# EasyEDA Pro project EasyEDA.epro

# Schematic Schematic1
Board Name: Board1; Create Date: 2025-06-01; Page Name: P1; Project Name: SmartRollerBlinds; Schematic Name: Schematic1; Update Date: 2025-07-07; Company: 嘉立创EDA; Page Size: A4; Version: V1.0
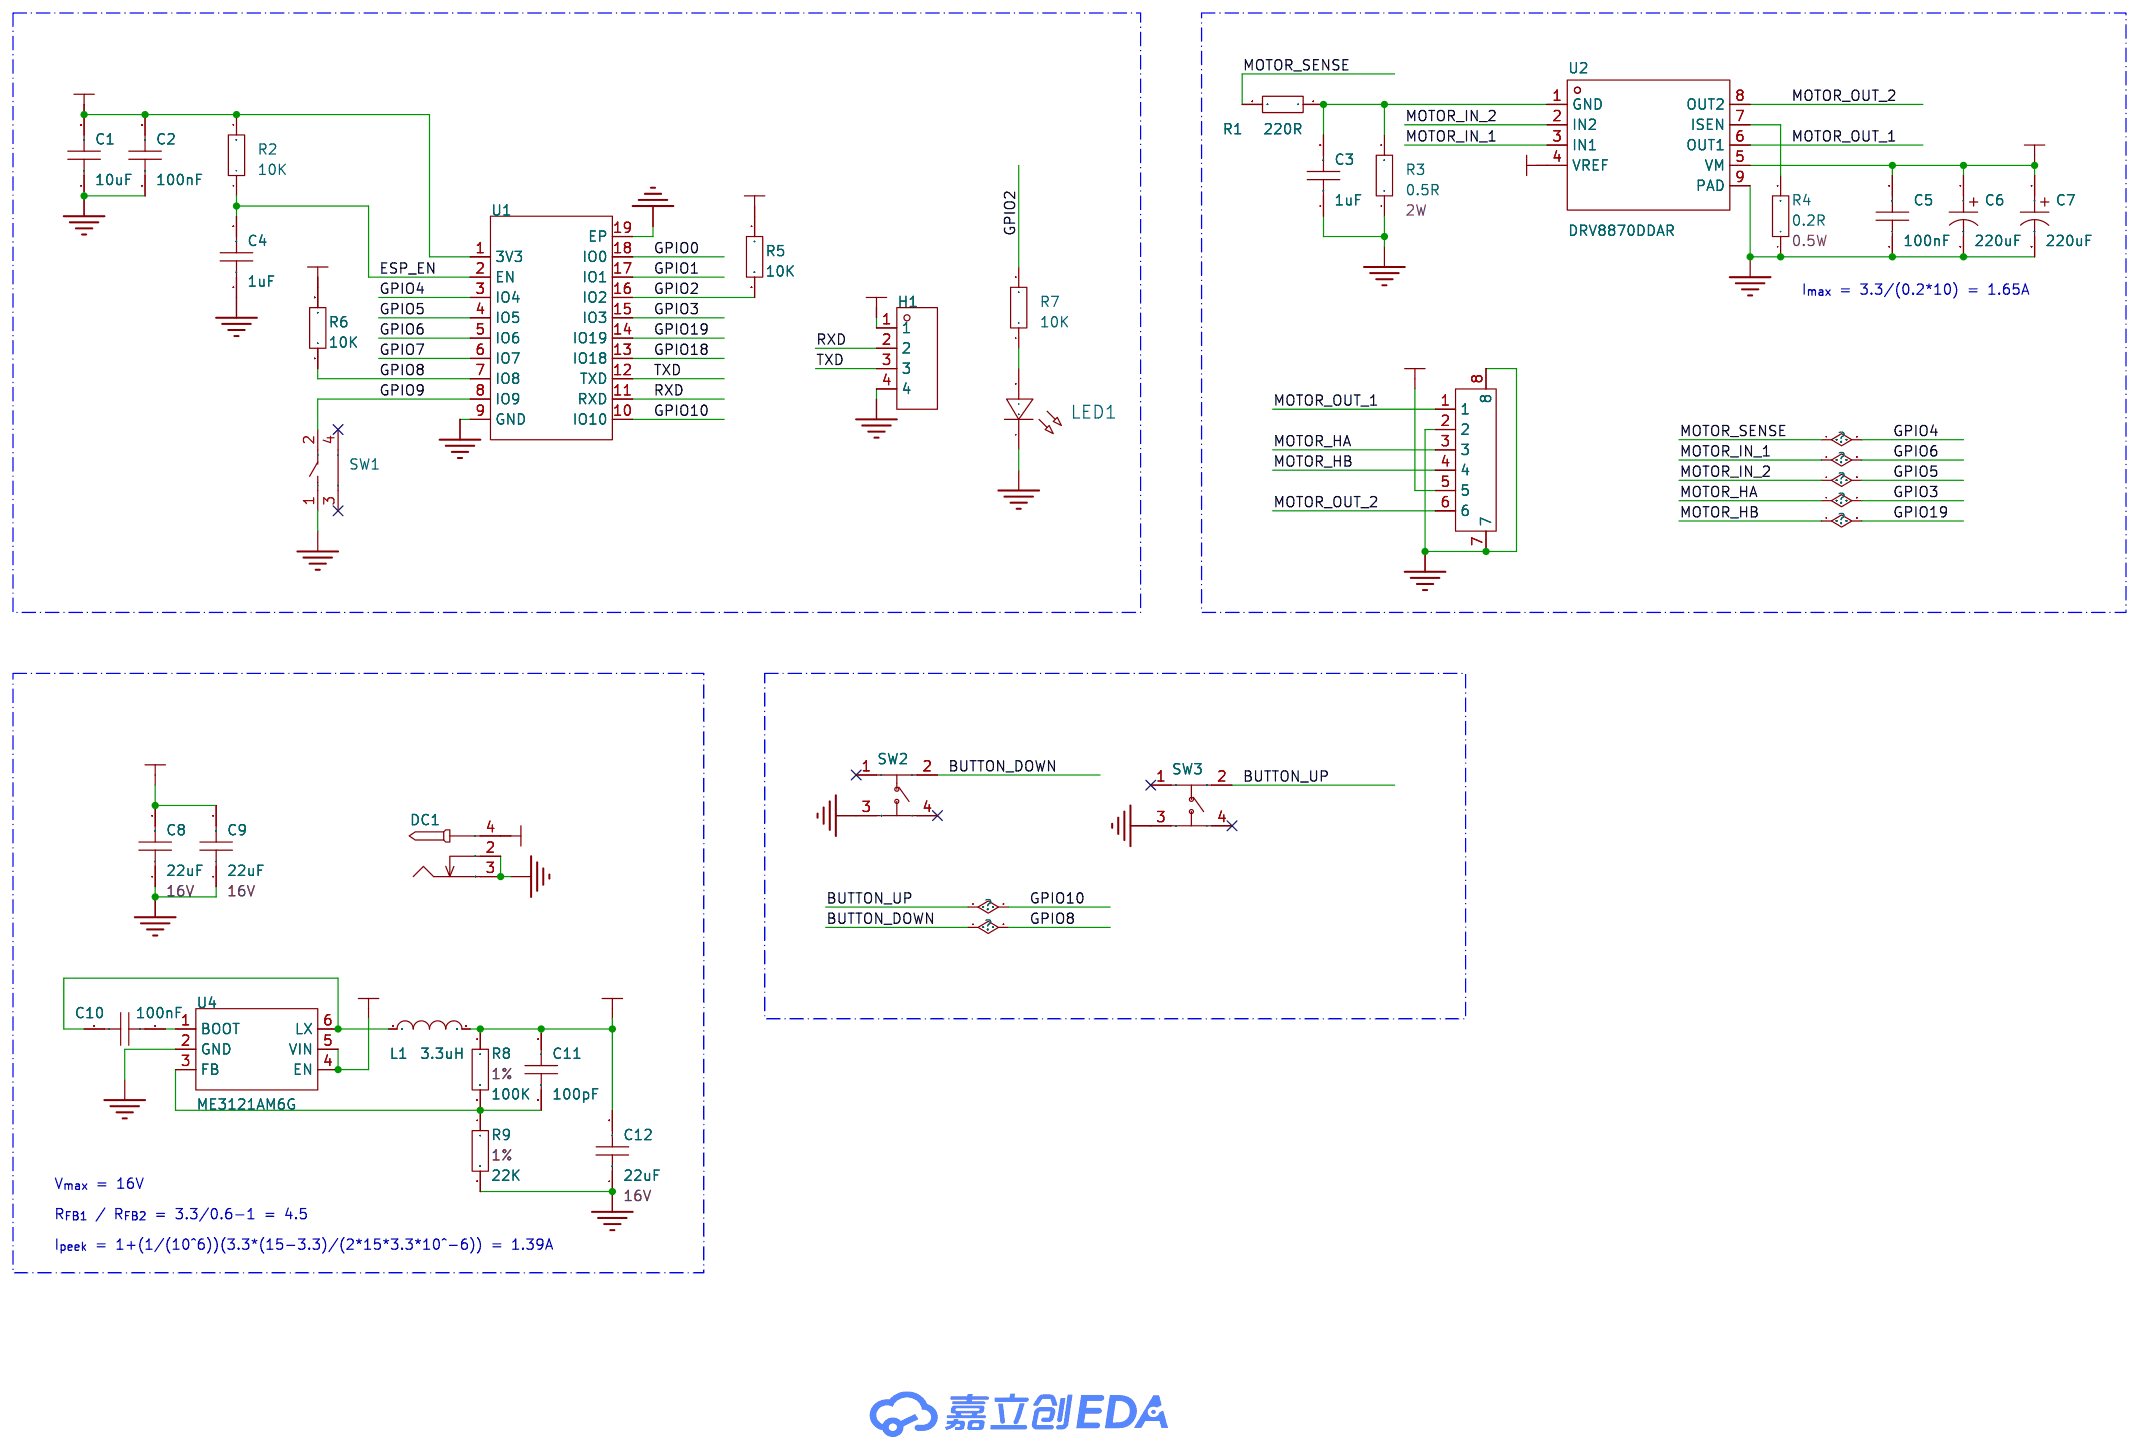
[diagram p0: schematic sheet]

## Parts
C1  10uF  [C0603]
C2  100nF  [C0603]
C3  1uF  [C0603]
C4  1uF  [C0603]
C5  100nF  [C0603]
C6  220uF  [CAP-SMD_BD6.3-L6.6-W6.6-FD]
C7  220uF  [CAP-SMD_BD6.3-L6.6-W6.6-FD]
C8  22uF  [C1206]
C9  22uF  [C1206]
C10  100nF  [C0603]
C11  100pF  [C0603]
C12  22uF  [C1206]
DC1  -  [DC-2.0]
H1  -  [HDR-TH_4P-P2.54-V-F]
L1  3.3uH  [IND-SMD_L2.5-W2.0_SWPA252012S]
LED1  -  [LED_0603]
R1  220R  [R0603]
R2  10K  [R0603]
R3  0.5R  [R2512]
R4  0.2R  [R1206]
R5  10K  [R0603]
R6  10K  [R0603]
R7  10K  [R0603]
R8  100K  [R0603]
R9  22K  [R0603]
SW1  GT-TC020A-H035-L05  [SW-SMD_GT-TC020B-H035-L05]
SW2  GT-TZ084B-H015-L1  [SW-SMD_4P-L5.2-W5.2-P3.70-LS6.4]
SW3  GT-TZ084B-H015-L1  [SW-SMD_4P-L5.2-W5.2-P3.70-LS6.4]
U1  2.4GHz  [BULETM-SMD_ESPRESSIF_ESP32-C3-WROOM-02-N4-4MB]
U2  DRV8870DDAR  [HSOP-8_L5.0-W4.0-P1.27-LS6.2-BL-EP]
U3  BX-PH2.0-6PLT  [CONN-SMD_6P-P2.00_BX-PH2.0-6PLT]
U4  ME3121AM6G  [SOT-23-6_L2.9-W1.6-P0.95-LS2.8-BR]

## Library data of the parts
C1-C5 C10 C11 = CAP_0603: Supplier Footprint: 0603
C6 C7 = RVT220UF16V67RV0015: 容值:220uF;精度:±20%;额定电压:16V;纹波电流:110mA@120Hz;等效串联电阻:-;; LCSC Part Name: 220uF ±20% 16V; Supplier Part: C2887273; Manufacturer: KNSCHA(科尼盛); Supplier Footprint: SMD,D6.3xL7.7mm; JLCPCB Part Class: 扩展库; Datasheet: https://atta.szlcsc.com/upload/public/pdf/source/20210824/3DC9999D9B098FE241E3A26137981C4C.pdf; Supplier: LCSC; Tolerance: ±20%; Rated Voltage: 16V; Ripple Current: 110mA@120Hz; φD: 6.3mm; L: 7.7mm; Lifetime @ Temp: 2000hrs@105℃; Operating Temperature: -55℃~+105℃
C8 C9 C12 = CAP_1206: 16V; Supplier Footprint: 1206
DC1 = DC-005_2.0: Supplier Footprint: 插件
H1 = HDR-F_2.54_1x4P: Supplier Part: C2718488; Supplier Footprint: 插件
L1 = 74404024022: 电感值:2.2uH;精度:±20%;额定电流:1.8A;饱和电流(Isat):1.95A;; LCSC Part Name: 2.2uH ±20% 1.95A; Supplier Part: C2046874; Manufacturer: Wurth(伍尔特); Supplier Footprint: 2520; JLCPCB Part Class: 扩展库; Datasheet: https://atta.szlcsc.com/upload/public/pdf/source/20210430/5965E2579F83C7E7E5B47693A7435A91.pdf; Supplier: LCSC; Tolerance: ±20%; Rated Current: 1.8A; Saturation Current (Isat): 1.95A; DC Resistance (DCR): 80mΩ; Ratings: AEC-Q200
LED1 = LED_0603-R: Supplier Footprint: 0603
R1 R2 R5-R7 = Res_0603: Supplier Footprint: 0603
R3 = 25121WF500LT4E: 电阻类型:厚膜电阻;阻值:500mΩ;精度:±1%;功率:1W;最大工作电压:200V;温度系数:±800ppm/℃;; LCSC Part Name: 500mΩ ±1% 1W 厚膜电阻; Supplier Part: C27777; Manufacturer: UNI-ROYAL(厚声); Supplier Footprint: 2512; JLCPCB Part Class: 扩展库; Datasheet: https://atta.szlcsc.com/upload/public/pdf/source/20200306/C422600_1E6D84923E4A46A82E41ADD87F860B5C.pdf; Supplier: LCSC; Type: 厚膜电阻; Tolerance: ±1%; Power(Watts): 2W; Overload Voltage (Max): 200V; Temperature Coefficient: ±800ppm/℃; Operating Temperature Range: -55℃~+155℃
R4 = Res_1206: 0.5W; Supplier Footprint: 1206
R8 R9 = Res_0603: 1%; Supplier Footprint: 0603
SW1 = GT-TC020A-H035-L05: 电路结构:单刀单掷;作用力:1.8N;安装方式:卧贴;带支架:带支架;触点电流:50mA;额定电压:12V;带灯:无;工作寿命:5万次;; LCSC Part Name: 2×4 带柱带支架轻触开关 180gf; Supplier Part: C17179533; Manufacturer: G-Switch(品赞); Supplier Footprint: SMD,2x4x3.5mm; JLCPCB Part Class: 扩展库; Datasheet: https://atta.szlcsc.com/upload/public/pdf/source/20230915/F4772B1177DC85E705E6967E2599032F.pdf; Supplier: LCSC; Circuit: 单刀单掷; Operating Force: 1.8N; Mounting Type: 卧贴; Strike Gundam: 带支架; Contact Current: 50mA; Voltage Rating: 12V; With Lamp: 无; Life: 5万次
SW2 SW3 = GT-TZ084B-H015-L1: 电路结构:单刀单掷;作用力:2.5N;开关长度:5.2mm;开关宽度:5.2mm;开关高度:1.5mm;带支架:不带;触点电流:50mA;额定电压(DC):12V;绝缘电阻:100mΩ;; LCSC Part Name: 4*4*1.5轻触开关; Supplier Part: C29780122; Manufacturer: G-Switch(品赞); Supplier Footprint: SMD-4P,5.2x5.2mm; JLCPCB Part Class: 扩展库; Datasheet: https://atta.szlcsc.com/upload/public/pdf/source/20240719/4891376090490F3A11AE408FF5E5C5E3.pdf; Supplier: LCSC; Circuit: 单刀单掷; Operating Force: 2.5N; Switch Length: 5.2mm; Switch Width: 5.2mm; Switch Height: 1.5mm; Strike Gundam: 不带; Contact Current: 50mA; Voltage Rating (DC): 12V; Insulation Resistance: 100mΩ; Actuator/Cap Color: 黑色; Operating Temperature: -40℃~+85℃
U1 = ESP32-C3-WROOM-02-N4: 核心处理器:ESP32-C3芯片;频率:2.4GHz;发射功率:20.5dBm;; Supplier Part: C2934560; Manufacturer: ESPRESSIF(乐鑫); Supplier Footprint: VFQFN-32-EP; JLCPCB Part Class: 扩展库; Datasheet: https://atta.szlcsc.com/upload/public/pdf/source/20220106/F07459EFFE1D7CBA94B4FB8A075146A6.pdf; Supplier: LCSC; Core Processor: ESP32-C3芯片; Support Interface: I2C；GPIO；SPI；JTAG；UART；USB；I2S; Output Power: 20.5dBm
U2 = DRV8870DDAR: DRV8870 具有电流调节功能的 50V、3.6A、H 桥电机驱动器; Supplier Part: C86590; Manufacturer: TI(德州仪器); Supplier Footprint: HSOP-8-EP; JLCPCB Part Class: 扩展库; Datasheet: https://www.ti.com/cn/lit/gpn/drv8870; Supplier: LCSC
U3 = BX-PH2.0-6PLT: 插针结构:1x6P;间距:2mm;安装方式:立贴;参考系列:PH;总PIN数:6P;排数:1;每排PIN数:6;行距:-;额定电流:2A;触头材质:黄铜;触头镀层:锡;工作温度:-25℃~+85℃;; LCSC Part Name: 1x6P 间距:2mm 立贴 系列:PH; Supplier Part: C18077903; Manufacturer: Bossie(博锡); Supplier Footprint: SMD,P=2mm; JLCPCB Part Class: 扩展库; Datasheet: https://atta.szlcsc.com/upload/public/pdf/source/20231017/4570E0C091E70AAE178BA8819F4CD7CC.pdf; Supplier: LCSC; Pins Structure: 1x6P; Pitch: 2mm; Mounting Type: 立贴; Reference Series: PH; Number of Pins: 6P; Number of Rows: 1; Number of PINs Per Row: 6; Current Rating: 2A; Contact Material: 黄铜; Contact Plating: 锡; Operating Temperature: -25℃~+85℃; Voltage Rating: 250V; Plastic Material: LCP; Supplementary Features: 辅助焊脚; Color: 米色; Z-Height of the Board: 6.3mm; X-Length of Bottom Edge on Board (Spacing Line): 16mm; Y-Width of Bottom Edge on Board: 7.5mm
U4 = ME3121AM6G: 功能类型:降压型;输出类型:可调;工作电压:4.7V~40V;输出电压:-;输出电流:-;; LCSC Part Name: 40V输入1A负载同步整流降压DC-DC转换器; Supplier Part: C2932938; Manufacturer: MICRONE(南京微盟); Supplier Footprint: SOT-23-6; JLCPCB Part Class: 扩展库; Datasheet: https://atta.szlcsc.com/upload/public/pdf/source/20220331/EB46EBF6ED46F90696A7B4CB82ED1A1E.pdf; Supplier: LCSC; Function: 降压型; Output Type: 可调; Voltage - Supply: 4.7V~40V; Frequency - Switching: 1MHz; Operating Temperature: -40℃~+85℃; Synchronous Rectifier: 是; Number of Outputs: 1; Topology: 降压式; Quiescent Current: 120uA; Switch tube (built-in/external): 内置

## Nets
3V3: C1.2 C2.2 C11.1 C12.2 H1.1 L1.2 R2.2 R5.1 R6.2 R8.1 U1.1(3V3) U2.4(VREF) U3.5
GND: C1.1 C2.1 C3.1 C4.1 C5.1 C6.2 C7.2 C8.1 C9.1 C12.1 DC1.2 DC1.3 H1.4 LED1.1(C) R3.1 R4.1 R9.2 SW1.1 SW2.3 SW3.3 U1.9(GND) U1.19(EP) U2.9(PAD) U3.2 U3.7 U3.8 U4.2(GND)
VBUS: C5.2 C6.1 C7.1 C8.2 C9.2 DC1.4 U2.5(VM) U4.4(EN) U4.5(VIN)
BUTTON_DOWN: R6.1 SW2.2 U1.7(IO8)
BUTTON_UP: SW3.2 U1.10(IO10)
ESP_EN: C4.2 R2.1 U1.2(EN)
GPIO0: U1.18(IO0)
GPIO1: U1.17(IO1)
GPIO2: R5.2 R7.2 U1.16(IO2)
GPIO3: U1.15(IO3) U3.3
GPIO4: R1.2 U1.3(IO4)
GPIO5: U1.4(IO5) U2.2(IN2)
GPIO6: U1.5(IO6) U2.3(IN1)
GPIO7: U1.6(IO7)
GPIO9: SW1.2 U1.8(IO9)
GPIO18: U1.13(IO18)
GPIO19: U1.14(IO19) U3.4
MOTOR_OUT_1: U2.6(OUT1) U3.1
MOTOR_OUT_2: U2.8(OUT2) U3.6
RXD: H1.2 U1.11(RXD)
TXD: H1.3 U1.12(TXD)
$1N357: C3.2 R1.1 R3.2 U2.1(GND)
$1N812: R4.2 U2.7(ISEN)
$1N4972: C10.2 L1.1 U4.6(LX)
$1N5063: C10.1 U4.1(BOOT)
$1N5157: C11.2 R8.2 R9.1 U4.3(FB)
Net-(LED1-2): LED1.2(A) R7.1

Not connected (* = marked no-connect by the designer): SW1 3* 4*; SW2 1* 4*; SW3 1* 4*

## Notes on the sheet
- I_{max} = 3.3/(0.2*10) = 1.65A
- V_{max} = 16V
- R_{FB1} / R_{FB2} = 3.3/0.6-1 = 4.5
- I_{peek} = 1+(1/(10^6))(3.3*(15-3.3)/(2*15*3.3*10^-6)) = 1.39A

# Board PCB1
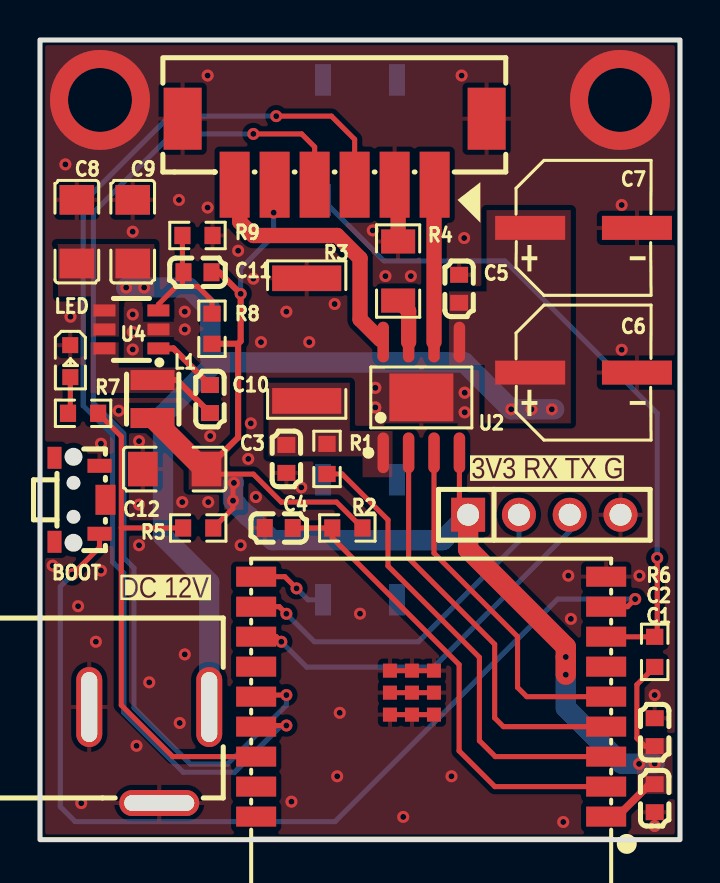
[diagram p1: board, top side]
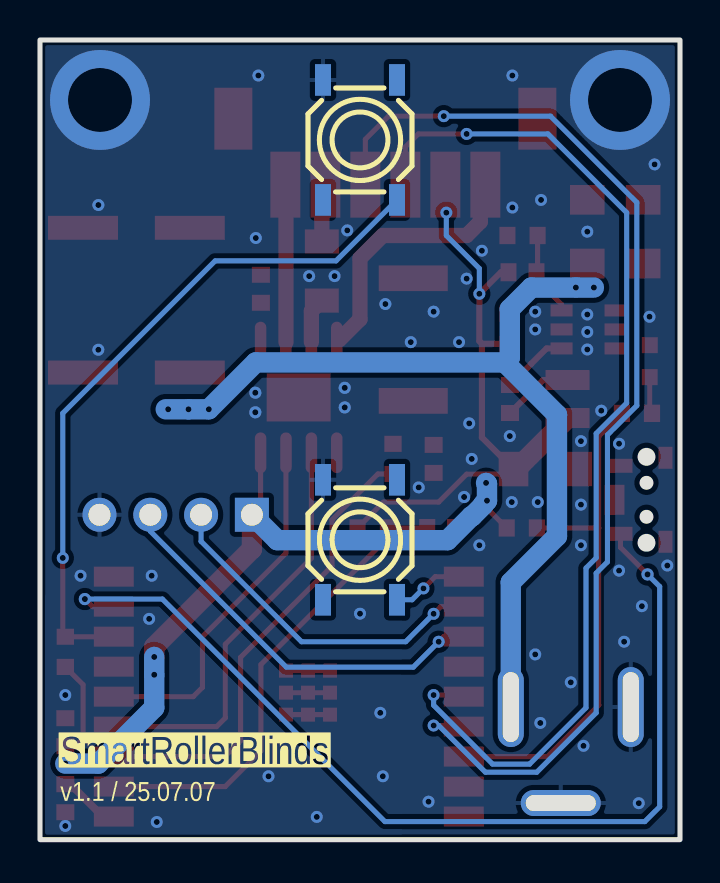
[diagram p2: board, bottom side, seen from below]

Outline 32 x 40 mm; copper layers: Top Layer, Bottom Layer. Coordinates in mm from the lower left corner of the outline.
Outline path: rectangle 0,40 32,0
Stack: Top Layer 0.035mm / Dielectric1 1.51mm FR4 er 4.5 / Bottom Layer 0.035mm

## Design rules (mm)
template: JLCPCB Capability(Two Layers Board)
spacing copperThickness1oz (default): track to track 0.102, other pairs 0.152 to 0.3
spacing copperThickness2oz: track to track 0.203, other pairs 0.152 to 0.3
track width copperThickness1oz (default): min 0.127, default 0.254, max 2.54
track width copperThickness2oz: min 0.203, default 0.254, max 2.54
differential pair differentialPair (default): width min 0.127, default 0.254, max 2.54; gap min 0.152, default 0.152
via viaSize (default): diameter min 0.5, default 0.61, max 10; hole min 0.3, default 0.305, max 6.3

## Placement (name value [footprint] x y rotation side)
BOOT  GT-TC020A-H035-L05  [SW-SMD_GT-TC020B-H035-L05]  2 17 270 top
C1  10uF  [C0603]  30.73 2.07 90 top
C2  100nF  [C0603]  30.73 5.38 270 top
C3  1uF  [C0603]  12.32 19.05 90 top
C4  1uF  [C0603]  11.94 15.59 0 top
C5  100nF  [C0603]  20.96 27.55 270 top
C6  220uF  [CAP-SMD_BD6.3-L6.6-W6.6-FD]  27.18 23.36 0 top
C7  220uF  [CAP-SMD_BD6.3-L6.6-W6.6-FD]  27.18 30.6 0 top
C8  22uF  [C1206]  1.84 30.41 270 top
C9  22uF  [C1206]  4.64 30.41 270 top
C10  100nF  [C0603]  8.5 22.04 270 top
C11  100pF  [C0603]  7.87 28.38 180 top
C12  22uF  [C1206]  6.73 18.54 0 top
DC1  -  [DC-2.0]  5.33 6.9 180 top
H1  -  [HDR-TH_4P-P2.54-V-F]  25.22 16.25 0 top
L1  3.3uH  [IND-SMD_L2.5-W2.0_SWPA252012S]  5.62 22.04 270 top
LED  -  [LED_0603]  1.52 23.89 270 top
R1  220R  [R0603]  14.35 19.05 270 top
R2  10K  [R0603]  15.37 15.59 0 top
R3  0.5R  [R2512]  13.34 25.01 270 top
R4  0.2R  [R1206]  17.91 28.44 270 top
R5  10K  [R0603]  7.91 15.59 180 top
R6  10K  [R0603]  30.73 9.39 270 top
R7  10K  [R0603]  2.15 21.33 0 top
R8  100K  [R0603]  8.6 25.56 90 top
R9  22K  [R0603]  7.87 30.22 0 top
SW2  GT-TZ084B-H015-L1  [SW-SMD_4P-L5.2-W5.2-P3.70-LS6.4]  16 35 270 bottom
SW3  GT-TZ084B-H015-L1  [SW-SMD_4P-L5.2-W5.2-P3.70-LS6.4]  16 15 270 bottom
U1  2.4GHz  [BULETM-SMD_ESPRESSIF_ESP32-C3-WROOM-02-N4-4MB]  19.56 7.15 180 top
U2  DRV8870DDAR  [HSOP-8_L5.0-W4.0-P1.27-LS6.2-BL-EP]  19.07 22.12 0 top
U3  BX-PH2.0-6PLT  [CONN-SMD_6P-P2.00_BX-PH2.0-6PLT]  14.73 34.41 180 top
U4  ME3121AM6G  [SOT-23-6_L2.9-W1.6-P0.95-LS2.8-BR]  4.57 25.52 0 top

## Footprints (pads in the part's own frame, mm; a bottom-side part is the same pattern mirrored in y, then rotated)
BULETM-SMD_ESPRESSIF_ESP32-C3-WROOM-02-N4-4MB
  rect 2x1 smd: 1(-8.75,6) 2(-8.75,4.5) 3(-8.75,3) 4(-8.75,1.5) 5(-8.75,0) 6(-8.75,-1.5) 7(-8.75,-3) 8(-8.75,-4.5) 9(-8.75,-6) 10(8.75,-6) 11(8.75,-4.5) 12(8.75,-3) 13(8.75,-1.5) 14(8.75,0) 15(8.75,1.5) 16(8.75,3) 17(8.75,4.5) 18(8.75,6)
  rect 0.7x0.7 smd: 19(-0.14,0.9) 19(-0.14,-0.2) 19(-0.14,-1.3) 19(0.96,0.9) 19(0.96,-0.2) 19(0.96,-1.3) 19(2.06,0.9) 19(2.06,-0.2) 19(2.06,-1.3)
C0603
  rect 0.8x0.9 smd: 1(-0.7,0) 2(0.7,0)
C1206
  rect 1.485x1.728 smd: 1(-1.593,0) 2(1.593,0)
CAP-SMD_BD6.3-L6.6-W6.6-FD
  rect 3.5x1.2 smd: 1(-2.67,0) 2(2.67,0)
CONN-SMD_6P-P2.00_BX-PH2.0-6PLT
  rect 1.5x3.3 smd: 1(-5,1.65) 2(-3,1.65) 3(-1,1.65) 4(1,1.65) 5(3,1.65) 6(5,1.65)
  rect 1.9x3.1 smd: 7(7.6,-1.65) 8(-7.6,-1.65)
DC-2.0
  oval 4x1.3 hole 3.5x0.8: 2(-0.627,5.067)
  oval 1.3x4 hole 0.8x3.5: 3(2.873,0.267) 4(-3.127,0.267)
HDR-TH_4P-P2.54-V-F
  rect 1.7x1.7 hole 1.1: 1(-3.81,0)
  round 1.7 hole 1.1: 2(-1.27,0) 3(1.27,0) 4(3.81,0)
HSOP-8_L5.0-W4.0-P1.27-LS6.2-BL-EP
  oval 0.574x2.038 smd: 1(-1.905,-2.769) 2(-0.635,-2.769) 3(0.635,-2.769) 4(1.905,-2.769) 5(1.905,2.769) 6(0.635,2.769) 7(-0.635,2.769) 8(-1.905,2.769)
  rect 3.2x2.4 smd: 9(0,0)
IND-SMD_L2.5-W2.0_SWPA252012S
  rect 1x2.2 smd: 1(-0.951,0) 2(0.951,0)
LED_0603
  rect 0.8x0.8 smd: 1(-0.851,-0.01) 2(0.75,-0.005)
R0603
  rect 0.806x0.864 smd: 1(-0.753,0) 2(0.753,0)
R1206
  rect 1.208x1.701 smd: 1(-1.479,0) 2(1.479,0)
R2512
  rect 1.282x3.456 smd: 1(-3.067,0) 2(3.067,0)
SOT-23-6_L2.9-W1.6-P0.95-LS2.8-BR
  rect 1.1x0.6 smd: 1(1.35,-0.95) 2(1.35,0) 3(1.35,0.95) 4(-1.35,0.95) 5(-1.35,0) 6(-1.35,-0.95)
SW-SMD_4P-L5.2-W5.2-P3.70-LS6.4
  rect 1.58x0.8 smd: 1(-3,1.85) 2(3,1.85) 3(-3,-1.85) 4(3,-1.85)
SW-SMD_GT-TC020B-H035-L05
  rect 0.7x1.2 smd: 1(-1.7,0.975) 2(1.7,0.975)
  rect 1.5x1 smd: 3(0,1.275)
  rect 1.1x0.7 smd: 4(-2.1,-1.275) 4(2.1,-1.275)

## Nets
As in the schematic, except:
GND: BOOT.1 C1.1 C2.1 C3.1 C4.1 C5.1 C6.2 C7.2 C8.1 C9.1 C12.1 DC1.2 DC1.3 H1.4 LED.1 R3.1 R4.1 R9.2 SW2.3 SW3.3 U1.9 U1.19 U2.9 U3.2 U3.7 U3.8 U4.2
GPIO9: BOOT.2 U1.8
$1N6245: LED.2 R7.1

Pads without a net: BOOT 3 4; SW2 1 4; SW3 1 4

## Via types
v1: diameter 0.6, hole 0.3, Top Layer to Bottom Layer, 78 vias
v2: diameter 5, hole 3.2, Top Layer to Bottom Layer, 2 vias
v3: diameter 0.61, hole 0.305, Top Layer to Bottom Layer, 7 vias

## Routing (per net, layer and track width the routed paths; a pad name or vN(x,y) marks a point on that pad's centre or on a via; arc(x,y) is an arc through that point)
3V3: length 76.5
  Top Layer w0.254: C12.2 8.58,18.28 10.67,18.28 12.06,16.89 14.82,16.89 R2.2 ; v1(9.7,17.85) 9.65,17.8 v1(9.65,16.96) 9.65,16.58 R5.1 ; U2.4 20.97,16.69 H1.1 ; R6.2 29.84,7.75 29.84,5.08 30.24,4.68 C2.2
  Top Layer w0.305: C11.1 8.96,28.38 v1(10.03,27.3) 10.03,24.93 9.91,24.81 ; C12.2 9.91,20.12 9.91,24.81 ; R8.1 8.6,24.81 9.91,24.81
  Top Layer w0.381: C1.2 30.48,2.77 28.99,1.28 28.44,1.28 U1.1
  Top Layer w1.016: v1(26.29,8.25) v1(26.29,9.14) 26.29,9.65 21.41,14.53 H1.1 ; C12.2 8.18,18.54 L1.2
  Bottom Layer w0.254: v1(11.68,31.36) 11.68,30.22 10.03,28.57 v1(10.03,27.3)
  Bottom Layer w1.016: v1(9.7,17.85) 9.65,17.8 v1(9.65,16.96) 9.83,16.78 9.83,16.74 10.4,16.17 10.43,16.17 11.63,14.98 20.14,14.98 H1.1 ; v1(26.29,9.14) v1(26.29,8.25) 26.29,6.6 29.08,3.81 v1(30.73,3.81)
  vias: v1(29.95,3.79)
GND: length 9.5
  Top Layer w0.254: U1.19 U1.19 U1.19 ; U1.19 U1.19 U1.19 ; U1.19 U1.19 U1.19
  Top Layer w0.762: R4.1 17.91,32.59 U3.2
  vias: v1(0.63,13.71) v1(1.27,33.78) v1(1.52,26.16) v1(1.91,11.68) v1(2.06,1.83) v1(2.79,9.9) v1(3.05,19.81) v1(3.05,13.46) v1(3.94,21.46) v1(4.64,30.41) v1(4.64,26.27) v1(4.64,25.39) v1(4.64,24.52) v1(4.83,4.69) v1(4.95,19.93) v1(4.95,16.76) v1(4.95,14.73) v1(5.46,7.87) v1(6.95,32) v1(6.99,5.84) v1(7.11,16.89) v1(7.24,26.41) v1(7.24,25.52) v1(7.24,9.27) v1(8.38,38.22) v1(8.38,31.62) v1(8.41,16.89) v1(8.51,20.19) v1(9.91,29.46) v1(10.03,14.73) v1(10.41,19.05) v1(10.54,20.82) v1(10.67,28.06) v1(11.05,24.89) v1(12.32,26.41) v1(12.57,1.9) v1(13.06,17.62) v1(13.46,24.89) v1(14.73,26.79) v1(14.86,3.17) v1(14.99,6.34) v1(16,11.3) v1(16.64,30.47) v1(17.27,28.19) v1(18.16,1.14) v1(18.54,28.19) v1(20.57,3.17) v1(21.08,38.22) v1(21.21,30.09) v1(26.16,0.88) v1(26.42,13.2) v1(26.54,11.04) v1(29.08,31.75) v1(29.08,24.51) v1(29.97,13.2) v1(30.73,7.23) v1(30.73,0.68) v2(3,37) v2(29,37) v3(10.79,17.14) v3(16.76,22.6) v3(16.76,21.62) v3(21.23,22.36) v3(21.23,21.38)
VBUS: length 44.6
  Bottom Layer w1.016: 8.76,23.87 6.15,21.26 6.15,15.18 8.46,12.87 DC1.4 ; 8.76,23.87 8.51,24.12 8.51,26.54 7.43,27.62 v1(5.21,27.62) v1(4.31,27.62) ; 8.76,23.87 21.22,23.87 v1(23.56,21.53) v1(24.57,21.53) 25.71,21.53
  vias: v1(25.59,21.53)
BUTTON_DOWN: length 34.8
  Top Layer w0.254: v1(30.86,14.09) 30.86,10.27 R6.1 28.32,10.15 U1.7
  Bottom Layer w0.254: v1(30.86,14.09) 30.86,21.33 23.24,28.95 17.2,28.95 SW2.2
BUTTON_UP: length 3.8
  Top Layer w0.254: U1.10 12.24,13.15 v1(12.83,12.57)
  Bottom Layer w0.254: v1(12.83,12.57) 13.4,12 SW3.2
ESP_EN: length 23.8
  Top Layer w0.254: U1.2 22.74,2.65 20.96,4.44 20.96,8.76 14.61,15.1 R2.1 C4.2
GPIO2: length 26
  Top Layer w0.254: 4.06,15.6 4.07,15.59 R5.2 ; 4.06,15.6 4.06,6.73 6.64,4.15 U1.16 ; 4.06,15.6 4.06,20.17 R7.2
GPIO3: length 56.3
  Top Layer w0.254: v1(11.81,36.19) 14.57,36.19 15.73,35.03 U3.3 ; U1.15 10.86,5.71 v1(12.32,5.71)
  Bottom Layer w0.254: v1(12.32,5.71) 12.06,5.71 9.73,3.37 7.16,3.37 4.19,6.34 4.19,13.33 3.63,13.89 3.63,20.24 2.16,21.71 2.16,31.87 6.48,36.19 v1(11.81,36.19)
GPIO4: length 23.6
  Top Layer w0.254: R1.2 15.1,18.29 17.4,16 17.4,13.69 21.97,9.12 21.97,4.95 22.76,4.15 U1.3
GPIO5: length 20.8
  Top Layer w0.254: U1.4 23.17,5.65 22.73,6.09 22.73,9.77 18.43,14.08 U2.2
GPIO6: length 18.1
  Top Layer w0.254: U1.5 24.34,7.15 23.88,7.61 23.88,10.16 19.7,14.33 U2.3
GPIO9: length 49.7
  Top Layer w0.254: v3(29.76,12.03) 29.38,11.65 U1.8 ; BOOT.2 2.97,14.62 v3(1.62,13.27)
  Bottom Layer w0.254: v3(29.76,12.03) 25.88,12.03 14.75,0.9 1.76,0.9 1.02,1.65 1.02,12.66 v3(1.62,13.27)
GPIO19: length 52.5
  Top Layer w0.254: U1.14 10.89,7.23 v1(12.32,7.23) ; v1(10.67,35.3) 13.08,35.3 13.73,34.65 U3.4
  Bottom Layer w0.254: v1(12.32,7.23) 12.32,6.73 9.37,3.78 7.52,3.78 4.7,6.6 4.7,13.58 4.19,14.09 4.19,20.31 2.67,21.84 2.67,31.36 6.6,35.3 v1(10.67,35.3)
MOTOR_OUT_1: length 7.9
  Top Layer w0.762: U3.1 19.7,32.73 U2.6
MOTOR_OUT_2: length 13.4
  Top Layer w0.508: U2.8 17.03,25.02 17.02,25.02
  Top Layer w0.762: 17.02,25.02 16,26.03 16,29.08 14.86,30.22 10.67,30.22 9.99,30.9 9.99,32.51 U3.6
RXD: length 17.3
  Top Layer w0.254: v1(12.32,11.3) 11.96,11.65 U1.11
  Bottom Layer w0.254: H1.2 23.95,14.92 18.92,9.9 13.72,9.9 v1(12.32,11.3)
TXD: length 19.9
  Top Layer w0.254: U1.12 11.81,10.15 v1(12.07,9.9)
  Bottom Layer w0.254: H1.3 26.49,15.43 19.69,8.63 13.34,8.63 v1(12.07,9.9)
$1N812: length 2.3
  Top Layer w0.762: U2.7 18.43,26.44 R4.2
$1N4972: length 3.6
  Top Layer w0.305: C10.2 6.85,22.99 L1.1
$1N5063: length 3.3
  Top Layer w0.305: U4.1 6.67,24.57 7.44,23.8 7.44,23.8 C10.1
$1N5157: length 6.8
  Top Layer w0.254: 7.12,27.67 R9.1 ; 7.12,27.67 7.88,27.67 8.6,26.96 R8.2 ; 7.12,27.67 6.82,27.67 5.92,26.78 U4.3
$1N6245: length 1.9
  Top Layer w0.254: R7.1 1.52,21.44 LED.2

## Copper pours and planes (outline as drawn; the poured copper is in the pictures)
3V3 on Top Layer: 29.84,5.08 31.62,5.08 31.62,2.28 29.84,2.28
3V3 on Top Layer: 7.43,19.48 10.16,19.48 10.16,16.51 7.43,16.51
GND on Top Layer: 0,40 32,40 32,0 0,0
GND on Top Layer: 16.26,23.49 21.81,23.49 21.81,20.82 16.26,20.82
GND on Top Layer: 4.19,26.88 7.78,26.88 7.78,24.03 4.19,24.03
GND on Bottom Layer: 13.84,12.31 45.84,12.31 45.84,-27.69 13.84,-27.69
GND on Bottom Layer: 0,40 32,40 32,0 0,0
VBUS on Top Layer: 0.85,29.79 5.72,29.79 5.72,25.16 0.85,25.16
VBUS on Top Layer: 20.45,31.49 26.54,31.49 26.54,20.82 20.45,20.82
$1N357 on Top Layer: 11.43,22.86 17.63,22.86 17.63,18.13 11.43,18.13
$1N4972 on Top Layer: 2.51,24.88 6.99,24.88 6.99,22.35 2.51,22.35

## Text on the board
Bottom Silkscreen Layer: v1.1 / 25.07.07 | SmartRollerBlinds
Top Silkscreen Layer: DC 12V | 3V3 RX TX G
